# EAGLE design open-diversity (EAGLE 5.11)
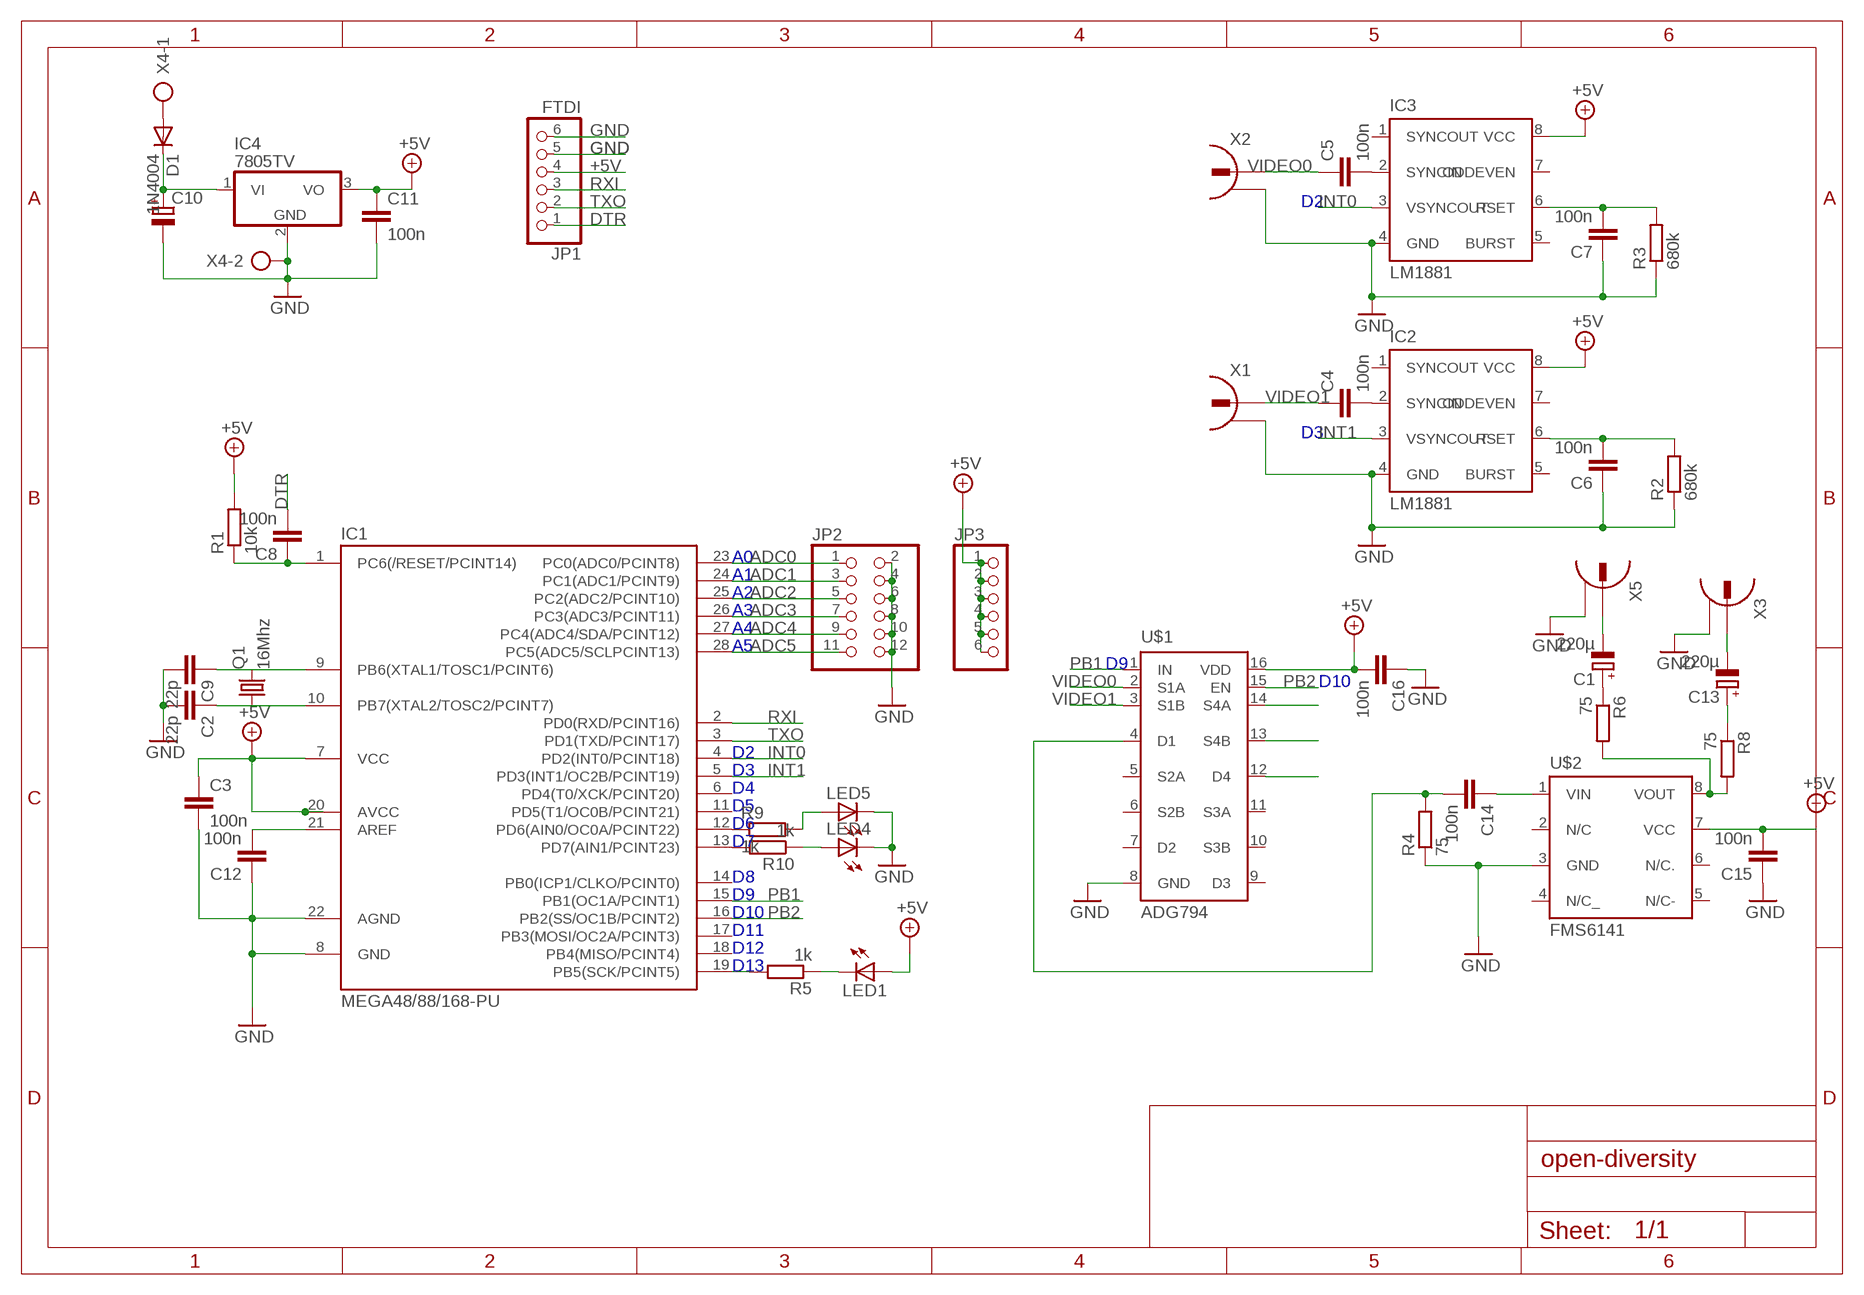
[diagram p0: schematic, sheet 1]

## Parts
C1  220µ  CPOL-EUE2.5-7  [E2,5-7]
C2  22p  C-EUC0805  [C0805]
C3  100n  C-EUC0805  [C0805]
C4  100n  C-EUC0805  [C0805]
C5  100n  C-EUC0805  [C0805]
C6  100n  C-EUC0805  [C0805]
C7  100n  C-EUC0805  [C0805]
C8  100n  C-EUC0805  [C0805]
C9  22p  C-EUC0805  [C0805]
C10  CPOL-EUE3.5-8  [E3,5-8]
C11  100n  C-EUC0805  [C0805]
C12  100n  C-EUC0805  [C0805]
C13  220µ  CPOL-EUE2.5-7  [E2,5-7]
C14  100n  C-EU050-030X075  [C050-030X075]
C15  100n  C-EUC0805  [C0805]
C16  100n  C-EUC0805  [C0805]
D1  1N4004  [DO41-10]
IC1  MEGA48/88/168-PU  [DIL28-3]
IC2  LM1881  [DIL08]
IC3  LM1881  [DIL08]
IC4  7805TV  [TO220V]
JP1  FTDI  PINHD-1X6  [1X06]
JP2  PINHD-2X6  [2X06]
JP3  PINHD-1X6  [1X06]
LED1  LED5MM  [LED5MM]
LED4  LED5MM  [LED5MM]
LED5  LED5MM  [LED5MM]
Q1  16Mhz  CRYSTALHC49S  [HC49/S]
R1  10k  R-EU_R0805  [R0805]
R2  680k  R-EU_R0805  [R0805]
R3  680k  R-EU_R0805  [R0805]
R4  75  R-EU_R0805  [R0805]
R5  1k  R-EU_R0805  [R0805]
R6  75  R-EU_R0805  [R0805]
R8  75  R-EU_R0805  [R0805]
R9  1k  R-EU_0207/10  [0207/10]
R10  1k  R-EU_R0805  [R0805]
U$1  ADG794  [QSOP16]
U$2  FMS6141  [SO8]
X1  736880-49  [736880-49]
X2  736880-49  [736880-49]
X3  736880-49  [736880-49]
X4  AK300/2  [AK300/2]
X5  736880-49  [736880-49]

## Nets
+5V: C3.1 C11.1 C15.2 C16.2 IC1.7(VCC) IC1.20(AVCC) IC2.8(VCC) IC3.8(VCC) IC4.3(VO) JP1.4 JP3.1 JP3.2 JP3.3 JP3.4 JP3.5 JP3.6 LED1.A R1.2 U$1.16(VDD) U$2.7(VCC)
ADC0: IC1.23(PC0(ADC0/PCINT8)) JP2.1
ADC1: IC1.24(PC1(ADC1/PCINT9)) JP2.3
ADC2: IC1.25(PC2(ADC2/PCINT10)) JP2.5
ADC3: IC1.26(PC3(ADC3/PCINT11)) JP2.7
ADC4: IC1.27(PC4(ADC4/SDA/PCINT12)) JP2.9
ADC5: IC1.28(PC5(ADC5/SCLPCINT13)) JP2.11
DTR: C8.2 JP1.1
GND: C2.2 C3.2 C6.1 C7.1 C9.2 C10.- C11.2 C12.1 C15.1 C16.1 IC1.8(GND) IC1.22(AGND) IC2.4(GND) IC3.4(GND) IC4.2(GND) JP1.5 JP1.6 JP2.2 JP2.4 JP2.6 JP2.8 JP2.10 JP2.12 LED4.K(C) LED5.K(C) R2.1 R3.1 R4.1 U$1.8(GND) U$2.3(GND) X1.2 X2.2 X3.2 X4.2 X5.2
INT0: IC1.4(PD2(INT0/PCINT18)) IC3.3(VSYNCOUT)
INT1: IC1.5(PD3(INT1/OC2B/PCINT19)) IC2.3(VSYNCOUT)
N$1: C8.1 IC1.1(PC6(/RESET/PCINT14)) R1.1
N$2: C9.1 IC1.9(PB6(XTAL1/TOSC1/PCINT6)) Q1.2
N$3: C2.1 IC1.10(PB7(XTAL2/TOSC2/PCINT7)) Q1.1
N$4: C12.2 IC1.21(AREF)
N$5: C4.2 IC2.2(SYNCIN)
N$6: C5.2 IC3.2(SYNCIN)
N$7: C6.2 IC2.6(RSET) R2.2
N$8: C7.2 IC3.6(RSET) R3.2
N$9: C14.1 U$2.1(VIN)
N$10: C14.2 R4.2 U$1.4(D1)
N$11: R6.2 R8.2 U$2.8(VOUT)
N$12: C13.+ R8.1
N$13: C1.+ R6.1
N$14: C1.- X5.1
N$15: IC1.19(PB5(SCK/PCINT5)) R5.2
N$16: D1.A X4.1
N$17: C10.+ D1.C IC4.1(VI)
N$18: LED1.K(C) R5.1
N$20: IC1.13(PD7(AIN1/PCINT23)) R10.2
N$21: IC1.12(PD6(AIN0/OC0A/PCINT22)) R9.1
N$22: LED4.A R10.1
N$23: LED5.A R9.2
N$24: C13.- X3.1
N$30: U$1.12(D4)
N$31: U$1.13(S4B)
N$32: U$1.14(S4A)
PB1: IC1.15(PB1(OC1A/PCINT1)) U$1.1(IN)
PB2: IC1.16(PB2(SS/OC1B/PCINT2)) U$1.15(EN)
RXI: IC1.2(PD0(RXD/PCINT16)) JP1.3
TXO: IC1.3(PD1(TXD/PCINT17)) JP1.2
VIDEO0: C5.1 U$1.2(S1A) X2.1
VIDEO1: C4.1 U$1.3(S1B) X1.1
Unconnected: IC1.6(PD4(T0/XCK/PCINT20)) IC1.11(PD5(T1/OC0B/PCINT21)) IC1.14(PB0(ICP1/CLKO/PCINT0)) IC1.17(PB3(MOSI/OC2A/PCINT3)) IC1.18(PB4(MISO/PCINT4)) IC2.1(SYNCOUT) IC2.5(BURST) IC2.7(ODDEVEN) IC3.1(SYNCOUT) IC3.5(BURST) IC3.7(ODDEVEN) U$1.5(S2A) U$1.6(S2B) U$1.7(D2) U$1.9(D3) U$1.10(S3B) U$1.11(S3A) U$2.2(N/C) U$2.5(N/C-) U$2.6(N/C.) X1.2@2 X2.2@2 X3.2@2 X5.2@2

## Notes on the sheet
- D2
- D3
- A0
- A1
- A2
- A3
- A4
- A5
- D9
- D10
- D2
- D3
- D4
- D5
- D6
- D7
- D8
- D9
- D10
- D11
- D12
- D13

## Power pins joined to a net without a drawn wire
N/C_: U$2.4(N/C_)

## Library data of the parts
C1 C10 C13 = rcl:CPOL-EU: POLARIZED CAPACITOR, European symbol
C2-C9 C11 C12 C14-C16 = rcl:C-EU: CAPACITOR, European symbol
D1 = diode:1N4004: DIODE general purpose rectifier, 1 A
IC1 = avr-4:MEGA48/88/168-PU
IC2 IC3 = lm1881:LM1881
IC4 = linear:78*: Positive VOLTAGE REGULATOR Source: http://cache.national.com/ds/LM/LM78L05.pdf http://www.fairchildsemi.com/ds/LM/LM7805.pdf
JP1 JP3 = pinhead:PINHD-1X6: PIN HEADER
JP2 = pinhead:PINHD-2X6: PIN HEADER
LED1 LED4 LED5 = led:LED: LED OSRAM: - CHIPLED LG R971, LG N971, LY N971, LG Q971, LY Q971, LO R971, LY R971 LH N974, LH R974 LS Q976, LO Q976, LY Q976 LO Q996 - Hyper CHIPLED LW Q18S LB Q993, LB Q99A, LB R99A - SideLED LS A670, LO A670, LY A670, LG A670, LP A670 LB A673, LV A673, LT A673, LW A673 LH A674 LY A675 LS A676, LA A676, LO A676, LY A676, LW A676 LS A679, LY A679, LG A679 - Hyper Micro SIDELED® LS Y876, LA Y876, LO Y876, LY Y876 LT Y87S - SmartLED LW L88C, LW L88S LB L89C, LB L89S, LG L890 LS L89K, LO L89K, LY L89K LS L896, LA L896, LO L896, LY L896 - TOPLED LS T670, LO T670, LY T670, LG T670, LP T670 LSG T670, LSP T670, LSY T670, LOP T670, LYG T670 LG T671, LOG T671, LSG T671 LB T673, LV T673, LT T673, LW T673 LH T674 LS T676, LA T676, LO T676, LY T676, LB T676, LH T676, LSB T676, LW T676 LB T67C, LV T67C, LT T67C, LS T67K, LO T67K, LY T67K, LW E67C LS E67B, LA E67B, LO E67B, LY E67B, LB E67C, LV E67C, LT E67C LW T67C LS T679, LY T679, LG T679 LS T770, LO T770, LY T770, LG T770, LP T770 LB T773, LV T773, LT T773, LW T773 LH T774 LS E675, LA E675, LY E675, LS T675 LS T776, LA T776, LO T776, LY T776, LB T776 LHGB T686 LT T68C, LB T68C - Hyper Mini TOPLED® LB M676 - Mini TOPLED Santana® LG M470 LS M47K, LO M47K, LY M47K Source: http://www.osram.convergy.de LUXEON: - LUMILED® LXK2-PW12-R00, LXK2-PW12-S00, LXK2-PW14-U00, LXK2-PW14-V00 LXK2-PM12-R00, LXK2-PM12-S00, LXK2-PM14-U00 LXK2-PE12-Q00, LXK2-PE12-R00, LXK2-PE12-S00, LXK2-PE14-T00, LXK2-PE14-U00 LXK2-PB12-K00, LXK2-PB12-L00, LXK2-PB12-M00, LXK2-PB14-N00, LXK2-PB14-P00, LXK2-PB14-Q00 LXK2-PR12-L00, LXK2-PR12-M00, LXK2-PR14-Q00, LXK2-PR14-R00 LXK2-PD12-Q00, LXK2-PD12-R00, LXK2-PD12-S00 LXK2-PH12-R00, LXK2-PH12-S00 LXK2-PL12-P00, LXK2-PL12-Q00, LXK2-PL12-R00 Source: www.luxeon.com KINGBRIGHT: KA-3528ASYC Source: www.kingbright.com
Q1 = crystal:CRYSTAL: CRYSTAL; OC_FARNELL: 1667008; OC_NEWARK: unknown
R1-R6 R8-R10 = rcl:R-EU_: RESISTOR, European symbol
U$1 = 001eigene:ADG794
U$2 = 001eigene:FMS6141
X1-X3 X5 = con-conrad:736880-49: Cinch Connector ( RCA Jack )
X4 = con-ptr500:AK300/2: CONNECTOR; OC_FARNELL: unknown; OC_NEWARK: unknown

## Board
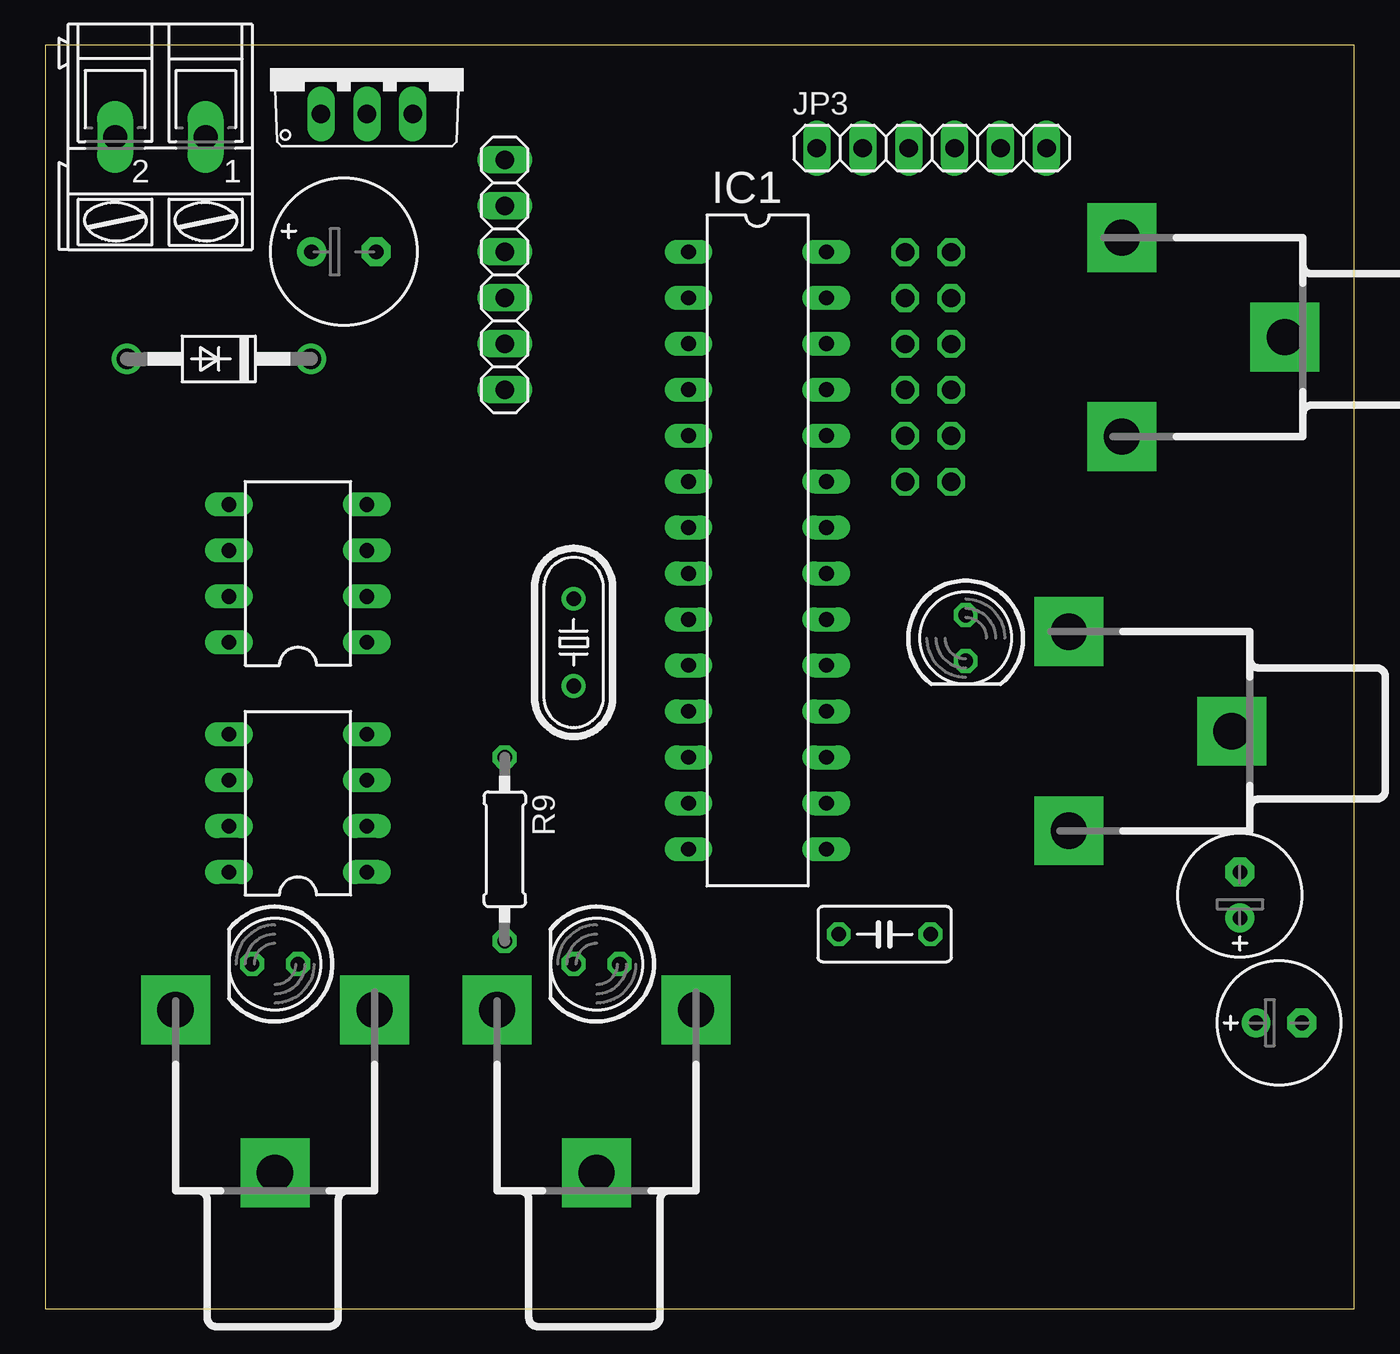
[diagram p1: board, top side]
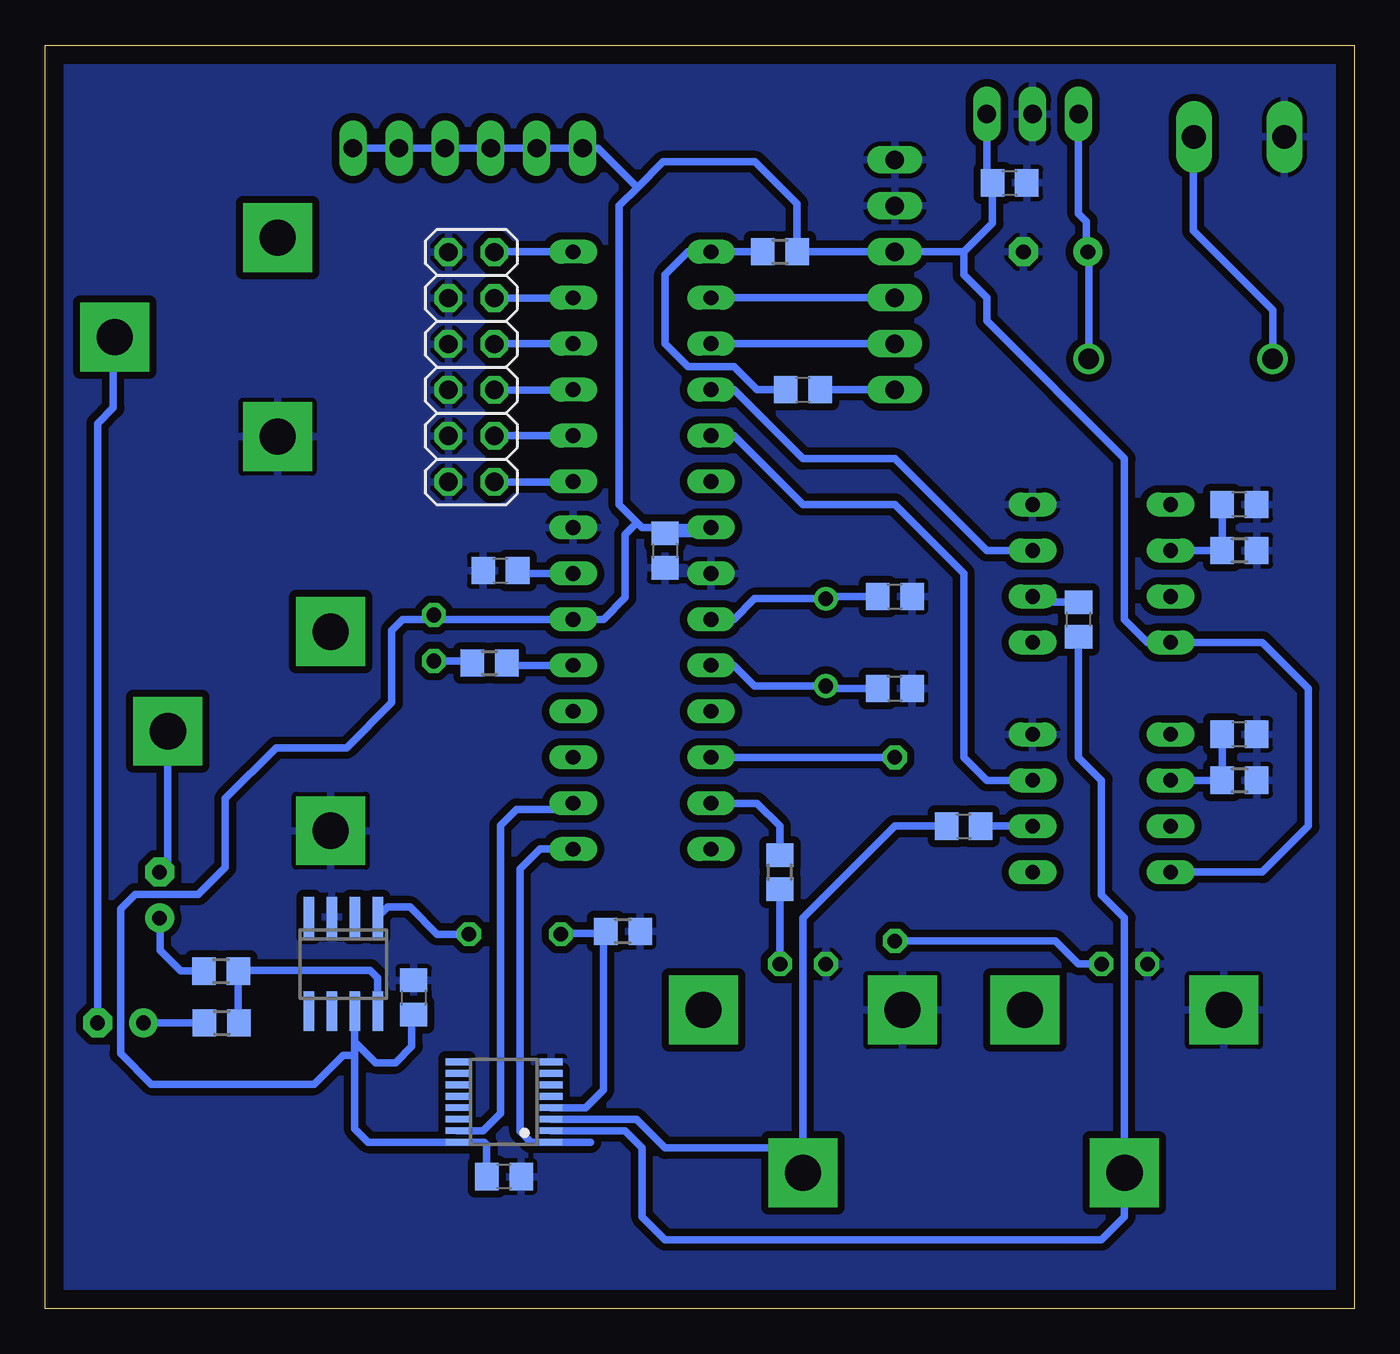
[diagram p2: board, bottom side, seen from below]

Size 72.36 x 69.84 mm. Coordinates in mm from the lower left corner, seen from the top.
Outline: 0,0 72.36,0 72.36,69.84 0,69.84 0,0
Copper layers (1*16): Top 0.035mm / dielectric 1.5mm / Bottom 0.035mm
Design rules "default": minimum track width 10mil, minimum drill 24mil, track to track 8mil, track to pad 8mil, pad to pad 8mil, via to via 8mil, smd to smd 8mil, copper to edge 40mil, drill to drill 8mil, minimum pad ring 10mil, minimum via ring 8mil, stop-mask expansion 4mil, vias tented up to drill 0mil, thermal gap 10mil

### Footprints (pad centres in the part's own frame; a part is rotated, then mirrored left to right if it is on the bottom)
E2,5-7 = drill 0.813 pad 1.6 round: + -1.27,0 | drill 0.813 pad 1.6 octagon: - 1.27,0
C0805 = smd 1.3 x 1.5: 1 -0.95,0; 2 0.95,0
E3,5-8 = drill 0.813 pad 1.6 round: + -1.778,0 | drill 0.813 pad 1.6 octagon: - 1.778,0
C050-030X075 = drill 0.813 octagon: 1 -2.54,0; 2 2.54,0
DO41-10 = drill 1.118 round: A 5.08,0; C -5.08,0
DIL28-3 = drill 0.813 long: 1 -16.51,-3.81; 2 -13.97,-3.81; 3 -11.43,-3.81; 4 -8.89,-3.81; 5 -6.35,-3.81; 6 -3.81,-3.81; 7 -1.27,-3.81; 8 1.27,-3.81; 9 3.81,-3.81; 10 6.35,-3.81; 11 8.89,-3.81; 12 11.43,-3.81; 13 13.97,-3.81; 14 16.51,-3.81; 15 16.51,3.81; 16 13.97,3.81; 17 11.43,3.81; 18 8.89,3.81; 19 6.35,3.81; 20 3.81,3.81; 21 1.27,3.81; 22 -1.27,3.81; 23 -3.81,3.81; 24 -6.35,3.81; 25 -8.89,3.81; 26 -11.43,3.81; 27 -13.97,3.81; 28 -16.51,3.81
DIL08 = drill 0.813 long: 1 -3.81,-3.81; 2 -1.27,-3.81; 3 1.27,-3.81; 4 3.81,-3.81; 5 3.81,3.81; 6 1.27,3.81; 7 -1.27,3.81; 8 -3.81,3.81
TO220V = drill 1.016 long: 1 -2.54,-2.54; 2 0,-2.54; 3 2.54,-2.54
1X06 = drill 1.016 long: 1 -6.35,0; 2 -3.81,0; 3 -1.27,0; 4 1.27,0; 5 3.81,0; 6 6.35,0
2X06 = drill 1.016 octagon: 1 -6.35,-1.27; 2 -6.35,1.27; 3 -3.81,-1.27; 4 -3.81,1.27; 5 -1.27,-1.27; 6 -1.27,1.27; 7 1.27,-1.27; 8 1.27,1.27; 9 3.81,-1.27; 10 3.81,1.27; 11 6.35,-1.27; 12 6.35,1.27
LED5MM = drill 0.813 octagon: A -1.27,0; K 1.27,0
HC49/S = drill 0.813 round: 1 -2.413,0; 2 2.413,0
R0805 = smd 1.3 x 1.5: 1 -0.95,0; 2 0.95,0
0207/10 = drill 0.813 octagon: 1 -5.08,0; 2 5.08,0
QSOP16 = smd 0.381 x 1.27: 1 0.318,-0.06; 2 0.953,-0.06; 3 1.587,-0.06; 4 2.223,-0.06; 5 2.857,-0.06; 6 3.493,-0.06; 7 4.128,-0.06; 8 4.763,-0.06; 9 4.763,5.14; 10 4.128,5.14; 11 3.493,5.14; 12 2.857,5.14; 13 2.223,5.14; 14 1.587,5.14; 15 0.953,5.14; 16 0.318,5.14
SO8 = smd 0.6 x 2.2: 1 0.635,-0.06; 2 1.905,-0.06; 3 3.175,-0.06; 4 4.445,-0.06; 5 4.445,5.14; 6 3.175,5.14; 7 1.905,5.14; 8 0.635,5.14
736880-49 = drill 2 pad 3.81 square: 1 -3.92,0; 2 5.08,5.5; 2@2 5.08,-5.5
AK300/2 = drill 1.321 long: 1 -2.515,0; 2 2.489,0

### Placement (x,y rotation side)
C1  68.2,15.8 0 top
C2  25.4,34.29 0 bottom
C3  38.1,41.91 270 bottom
C4  21.59,26.67 0 bottom
C5  15.24,38.1 90 bottom
C6  6.35,31.75 180 bottom
C7  6.35,44.45 180 bottom
C8  30.48,50.8 0 bottom
C9  25.4,39.37 0 bottom
C10  16.51,58.42 0 top
C11  19.05,62.23 0 bottom
C12  47.2,40.8 0 bottom
C13  66.04,22.86 90 top
C14  46.4,20.7 180 top
C15  52,17.2 270 bottom
C16  47,7.3 180 bottom
D1  9.6,52.5 180 top
IC1  39.37,41.91 270 top
IC2  13.97,27.94 90 top
IC3  13.97,40.64 90 top
IC4  17.78,68.58 0 top
JP1  25.4,57.15 90 top
JP2  48.8,52.05 90 bottom
JP3  49,64.15 0 top
LED1  50.88,37.07 270 top
LED4  30.48,19.05 180 top
LED5  12.7,19.05 180 top
Q1  29.21,36.83 90 top
R1  31.75,58.42 0 bottom
R2  6.35,29.21 180 bottom
R3  6.35,41.91 180 bottom
R4  40.43,20.86 180 bottom
R5  47.8,35.7 0 bottom
R6  62.6,15.8 0 bottom
R8  62.64,18.66 0 bottom
R9  25.4,25.4 270 top
R10  31.75,24.13 90 bottom
U$1  44.45,8.89 90 bottom
U$2  53.34,21.59 180 bottom
X1  30.48,11.43 90 top
X2  12.7,11.43 90 top
X3  61.66,31.92 180 top
X4  6.35,64.77 180 top
X5  64.6,53.7 180 top

### Tracks (layer width: path | path; a pad name or v marks a point on that pad's centre or on a via)
+5V
  Bottom 0.406: C3.1 35.88,42.86 IC1.7 39.37,43.18 39.65,43.45 | IC4.3 20.32,62.55 C11.1 20,60.01 21.59,58.42 | 21.59,58.42 JP1.4 R1.2 30.8,61.08 33.12,63.4 38.2,63.4 39.62,61.98 | 21.59,58.42 21.59,57.15 20.32,55.88 20.32,54.61 12.7,46.99 12.7,38.1 11.43,36.83 IC3.8 5.08,36.83 2.54,34.29 2.54,26.67 5.08,24.13 IC2.8 | 39.65,43.45 40.64,44.45 40.64,60.96 39.62,61.98 | 55.24,14 55.24,9.95 54.51,9.21 U$1.16 48.1,9.2 47.95,9.05 C16.2 | 55.24,14 U$2.7 55.24,14.74 54.1,13.6 53,13.6 52.1,14.5 52.1,16.15 C15.2 | 39.65,43.45 40.3,42.8 40.3,39.3 41.5,38.1 IC1.20 50.64,38.1 | 50.64,38.1 LED1.A | 50.64,38.1 52.6,38.1 53.2,37.5 53.2,33.5 55.7,31 59.6,31 62.4,28.2 62.4,24.4 63.9,22.9 67.4,22.9 68.2,22.1 68.2,14.1 66.5,12.4 57.5,12.4 55.9,14 55.24,14 | JP3.6 JP3.5 JP3.4 JP3.3 JP3.2 JP3.1 41.8,64.15 39.62,61.98
ADC0
  Bottom 0.406: JP2.1 43.18,45.7 IC1.23
ADC1
  Bottom 0.406: IC1.24 47.53,48.26 JP2.3
ADC2
  Bottom 0.406: JP2.5 43.18,50.78 IC1.25
ADC3
  Bottom 0.406: IC1.26 47.53,53.34 JP2.7
ADC4
  Bottom 0.406: JP2.9 43.18,55.86 IC1.27
ADC5
  Bottom 0.406: IC1.28 47.53,58.42 JP2.11
DTR
  Bottom 0.406: JP1.1 C8.2
GND
  pour Bottom (isolate 0.406): -1.27,74.93 81.28,74.93 81.28,-6.35 -1.27,-6.35
INT0
  Bottom 0.406: IC3.3 20.32,41.91 25.4,46.99 30.48,46.99 34.29,50.8 IC1.4
INT1
  Bottom 0.406: IC2.3 20.32,29.21 21.59,30.48 21.59,40.64 25.4,44.45 30.48,44.45 34.29,48.26 IC1.5
N$1
  Bottom 0.406: C8.1 33.02,50.8 34.29,52.07 36.83,52.07 38.1,53.34 38.1,57.15 36.83,58.42 IC1.1 R1.1
N$2
  Bottom 0.406: IC1.9 34.29,38.1 33.15,39.24 Q1.2 29.08,39.37 C9.1
N$3
  Bottom 0.406: IC1.10 34.29,35.56 33.15,34.42 Q1.1 29.08,34.29 C2.1
N$4
  Bottom 0.406: IC1.21 46.09,40.64 C12.2
N$5
  Bottom 0.406: IC2.2 C4.2
N$6
  Bottom 0.406: C5.2 17.46,39.05 IC3.2
N$7
  Bottom 0.406: C6.2 R2.2 IC2.6
N$8
  Bottom 0.406: IC3.6 R3.2 C7.2
N$9
  Bottom 0.406: C14.1 50.7,20.7 52.2,22.2 53.42,22.2 U$2.1
N$10
  Bottom 0.406: U$1.4 42.49,11.11 41.5,12.1 41.5,20.74 | 41.5,20.74 R4.2 | 41.5,20.74 43.62,20.74 C14.2
N$11
  Bottom 0.406: U$2.8 53.98,18.27 54.4,18.7 61.65,18.7 R8.2 61.69,15.84 R6.2
N$12
  Bottom 0.406: R8.1 64.86,18.66 66,19.8 66,21.55 C13.+
N$13
  Bottom 0.406: R6.1 C1.+
N$14
  Bottom 0.406: C1.- 69.47,48.93 68.6,49.8 68.6,53.62 X5.1
N$15
  Bottom 0.406: IC1.19 46.71,35.56 R5.2
N$16
  Bottom 0.406: X4.1 8.9,64.73 8.9,59.6 4.5,55.2 4.5,52.52 D1.A
N$17
  Bottom 0.406: IC4.1 15.24,60.54 14.8,60.1 14.8,58.49 C10.+ 14.68,58.37 D1.C
N$18
  Bottom 0.406: LED1.K 48.85,35.8 R5.1
N$20
  Bottom 0.406: IC1.13 33.02,27.94 31.75,26.67 R10.2
N$21
  Bottom 0.406: R9.1 IC1.12
N$22
  Bottom 0.406: LED4.A R10.1
N$23
  Bottom 0.406: R9.2 16.51,20.32 15.24,19.05 LED5.A
N$24
  Bottom 0.406: X3.1 65.58,24.59 C13.-
PB1
  Bottom 0.406: 42.23,9.21 U$1.1 45.51,9.21 46.1,9.8 46.1,24.3 45,25.4 IC1.15
PB2
  Bottom 0.406: U$1.15 48.16,9.84 47.2,10.8 47.2,26.7 46.3,27.6 43.52,27.6 IC1.16
RXI
  Bottom 0.406: JP1.3 IC1.2
TXO
  Bottom 0.406: JP1.2 IC1.3
VIDEO0
  Bottom 0.406: C5.1 15.24,30.48 13.97,29.21 13.97,22.86 12.7,21.59 X2.1 12.7,5.08 13.97,3.81 38.1,3.81 39.37,5.08 39.37,8.89 40.32,9.84 U$1.2
VIDEO1
  Bottom 0.406: C4.1 25.4,26.67 30.48,21.59 30.48,8.89 | X1.1 30.48,8.89 | U$1.3 39.69,10.48 38.1,8.89 30.48,8.89